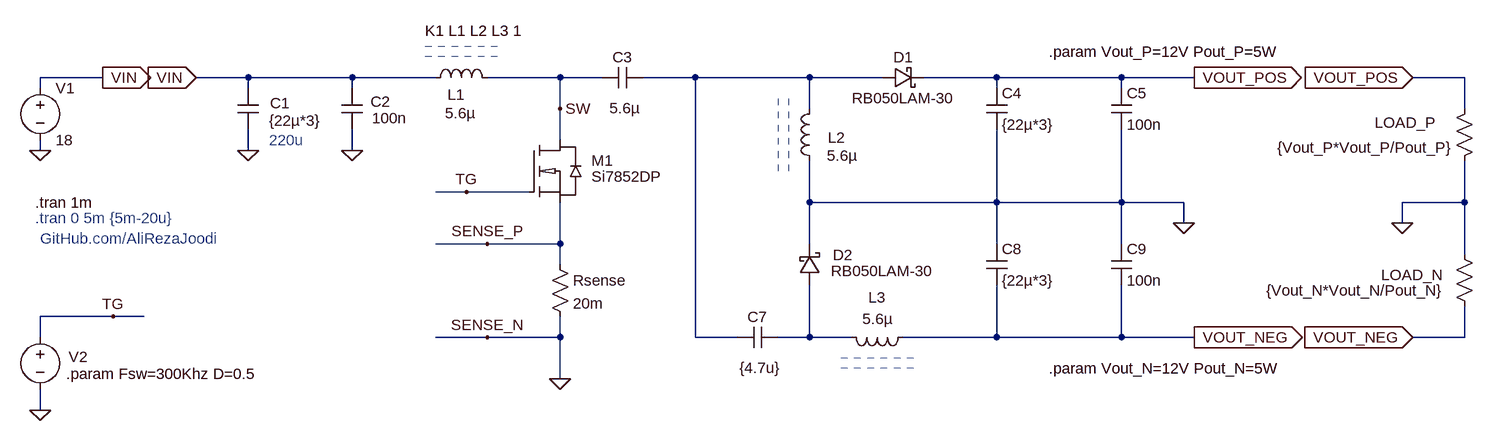
[diagram p0: schematic _PowerStage_Bipolar.asc]
_PowerStage_Bipolar.asc, the LTspice schematic file:
Version 4.1
SHEET 1 3620 1972
WIRE 1440 -400 1344 -400
WIRE 1664 -400 1584 -400
WIRE 1824 -400 1664 -400
WIRE 1952 -400 1824 -400
WIRE 2144 -400 2032 -400
WIRE 2208 -400 2144 -400
WIRE 2352 -400 2272 -400
WIRE 2528 -400 2352 -400
WIRE 2640 -400 2528 -400
WIRE 2816 -400 2704 -400
WIRE 3008 -400 2816 -400
WIRE 3120 -400 3008 -400
WIRE 3536 -400 3456 -400
WIRE 1344 -384 1344 -400
WIRE 1664 -384 1664 -400
WIRE 1824 -384 1824 -400
WIRE 2816 -384 2816 -400
WIRE 3008 -384 3008 -400
WIRE 2144 -352 2144 -400
WIRE 2528 -352 2528 -400
WIRE 3536 -352 3536 -400
WIRE 2144 -304 2144 -352
WIRE 1344 -288 1344 -304
WIRE 1664 -288 1664 -320
WIRE 1824 -288 1824 -320
WIRE 2000 -224 1952 -224
WIRE 2096 -224 2000 -224
WIRE 2528 -208 2528 -272
WIRE 2816 -208 2816 -320
WIRE 2816 -208 2528 -208
WIRE 3008 -208 3008 -320
WIRE 3008 -208 2816 -208
WIRE 3104 -208 3008 -208
WIRE 3536 -208 3536 -272
WIRE 3536 -208 3440 -208
WIRE 3104 -176 3104 -208
WIRE 3440 -176 3440 -208
WIRE 2032 -144 1952 -144
WIRE 2144 -144 2144 -208
WIRE 2144 -144 2032 -144
WIRE 2528 -144 2528 -208
WIRE 2816 -144 2816 -208
WIRE 3008 -144 3008 -208
WIRE 3536 -128 3536 -208
WIRE 2144 -112 2144 -144
WIRE 1456 -32 1344 -32
WIRE 1504 -32 1456 -32
WIRE 1344 0 1344 -32
WIRE 2032 0 1952 0
WIRE 2144 0 2144 -32
WIRE 2144 0 2032 0
WIRE 2352 0 2352 -400
WIRE 2416 0 2352 0
WIRE 2528 0 2528 -80
WIRE 2528 0 2480 0
WIRE 2592 0 2528 0
WIRE 2816 0 2816 -80
WIRE 2816 0 2672 0
WIRE 3008 0 3008 -80
WIRE 3008 0 2816 0
WIRE 3120 0 3008 0
WIRE 3536 0 3536 -48
WIRE 3536 0 3456 0
WIRE 2144 64 2144 0
WIRE 1344 112 1344 80
FLAG 1344 -288 0
FLAG 3120 -400 VOUT_POS
IOPIN 3120 -400 Out
FLAG 1440 -400 VIN
IOPIN 1440 -400 Out
FLAG 1824 -288 0
FLAG 3104 -176 0
FLAG 2032 -144 SENSE_P
FLAG 2032 0 SENSE_N
FLAG 2000 -224 TG
FLAG 1664 -288 0
FLAG 2144 64 0
FLAG 1584 -400 VIN
IOPIN 1584 -400 In
FLAG 3456 -400 VOUT_POS
IOPIN 3456 -400 In
FLAG 1344 112 0
FLAG 1456 -32 TG
FLAG 3120 0 VOUT_NEG
IOPIN 3120 0 Out
FLAG 3440 -176 0
FLAG 3456 0 VOUT_NEG
IOPIN 3456 0 In
FLAG 2144 -352 SW
SYMBOL schottky 2640 -416 M90
WINDOW 0 0 32 VBottom 2
WINDOW 3 32 32 VTop 2
SYMATTR InstName D1
SYMATTR Value RB050LAM-30
SYMATTR Description Diode
SYMATTR Type diode
SYMBOL ind 1936 -384 R270
WINDOW 0 -26 48 VTop 2
WINDOW 3 -23 55 VBottom 2
SYMATTR InstName L1
SYMATTR Value 5.6µ
SYMATTR SpiceLine Rser=47m
SYMATTR Type ind
SYMBOL res 2128 -128 R0
SYMATTR InstName Rsense
SYMATTR Value 20m
SYMBOL voltage 1344 -400 R0
WINDOW 123 24 138 Left 2
WINDOW 39 24 117 Left 2
SYMATTR Value 18
SYMATTR InstName V1
SYMBOL res 3552 -368 M0
WINDOW 0 60 37 Left 2
SYMATTR InstName LOAD_P
SYMATTR Value {Vout_P*Vout_P/Pout_P}
SYMBOL cap 1808 -384 R0
WINDOW 0 44 21 Left 2
WINDOW 3 47 46 Left 2
SYMATTR InstName C2
SYMATTR Value 100n
SYMBOL cap 1648 -384 R0
WINDOW 0 50 23 Left 2
WINDOW 3 48 50 Left 2
SYMATTR InstName C1
SYMATTR Value {22µ*3}
SYMBOL cap 2992 -384 R0
SYMATTR InstName C5
SYMATTR Value 100n
SYMBOL cap 2800 -384 R0
SYMATTR InstName C4
SYMATTR Value {22µ*3}
SYMBOL cap 2208 -384 R270
WINDOW 0 32 32 VTop 2
WINDOW 3 -15 36 VBottom 2
SYMATTR InstName C3
SYMATTR Value 5.6µ
SYMATTR SpiceLine Rser=0.01
SYMBOL ind 2544 -256 R180
WINDOW 0 -39 52 Left 2
WINDOW 3 -11 24 Right 2
SYMATTR InstName L2
SYMATTR Value 5.6µ
SYMATTR SpiceLine Rser=47m
SYMATTR Type ind
SYMBOL voltage 1344 -16 R0
WINDOW 3 41 64 Invisible 2
WINDOW 123 0 0 Left 0
WINDOW 0 44 46 Left 2
SYMATTR Value PULSE(0 12 0 {0.01/Fsw} {0.01/Fsw} {D/Fsw} {1/Fsw})
SYMATTR SpiceLine Rser=10
SYMATTR InstName V2
SYMBOL schottky 2512 -80 M180
WINDOW 0 52 47 Left 2
WINDOW 3 49 22 Left 2
SYMATTR InstName D2
SYMATTR Value RB050LAM-30
SYMATTR Description Diode
SYMATTR Type diode
SYMBOL ind 2688 -16 R90
WINDOW 0 -30 56 VBottom 2
WINDOW 3 -28 55 VTop 2
SYMATTR InstName L3
SYMATTR Value 5.6µ
SYMATTR SpiceLine Rser=47m
SYMATTR Type ind
SYMBOL cap 2416 16 R270
WINDOW 0 32 32 VTop 2
WINDOW 3 -15 36 VBottom 2
SYMATTR InstName C7
SYMATTR Value {4.7u}
SYMATTR SpiceLine Rser=0.01
SYMBOL cap 2800 -144 R0
SYMATTR InstName C8
SYMATTR Value {22µ*3}
SYMBOL cap 2992 -144 R0
SYMATTR InstName C9
SYMATTR Value 100n
SYMBOL res 3552 -32 R180
WINDOW 0 48 64 Left 2
WINDOW 3 48 40 Left 2
SYMATTR InstName LOAD_N
SYMATTR Value {Vout_N*Vout_N/Pout_N}
SYMBOL MyLib\\Transistor_MOSFET_N\\MOSFET_N 2096 -304 R0
SYMATTR InstName M1
SYMATTR Value Si7852DP
TEXT 1336 -208 Left 2 !.tran 1m
TEXT 1344 -152 Left 2 ;GitHub.com/AliRezaJoodi
TEXT 1936 -472 Left 2 !K1 L1 L2 L3 1
TEXT 1696 -304 Left 2 ;220u
TEXT 2896 -440 Left 2 !.param Vout_P=12V Pout_P=5W
TEXT 1336 -184 Left 2 ;.tran 0 5m {5m-20u}
TEXT 1384 56 Left 2 !.param Fsw=300Khz D=0.5
TEXT 2896 48 Left 2 !.param Vout_N=12V Pout_N=5W
LINE Normal 2048 -432 1936 -432 2
LINE Normal 2048 -448 1936 -448 2
LINE Normal 2480 -256 2480 -368 2
LINE Normal 2496 -256 2496 -368 2
LINE Normal 2688 48 2576 48 2
LINE Normal 2688 32 2576 32 2

The netlist it stands for:
* _PowerStage_Bipolar.asc
D1 N001 VOUT_POS RB050LAM-30
L1 VIN SW 5.6µ Rser=47m
Rsense SENSE_P 0 20m
V1 VIN 0 18
R§LOAD_P VOUT_POS 0 {Vout_P*Vout_P/Pout_P}
C2 VIN 0 100n
C1 VIN 0 {22µ*3}
C5 VOUT_POS 0 100n
C4 VOUT_POS 0 {22µ*3}
C3 SW N001 5.6µ Rser=0.01
L2 0 N001 5.6µ Rser=47m
V2 TG 0 PULSE(0 12 0 {0.01/Fsw} {0.01/Fsw} {D/Fsw} {1/Fsw}) Rser=10
D2 N002 0 RB050LAM-30
L3 VOUT_NEG N002 5.6µ Rser=47m
C7 N001 N002 {4.7u} Rser=0.01
C8 0 VOUT_NEG {22µ*3}
C9 0 VOUT_NEG 100n
R§LOAD_N VOUT_NEG 0 {Vout_N*Vout_N/Pout_N}
M1 SW TG SENSE_P SENSE_P Si7852DP
.model D D
.lib standard.dio
.model NMOS NMOS
.model PMOS PMOS
.lib standard.mos
.tran 1m
* GitHub.com/AliRezaJoodi
K1 L1 L2 L3 1
* 220u
.param Vout_P=12V Pout_P=5W
* .tran 0 5m {5m-20u}
.param Fsw=300Khz D=0.5
.param Vout_N=12V Pout_N=5W
.backanno
.end